# EAGLE design pc_healthypi_move_sensor_connector_v4 (EAGLE 9.6.2)
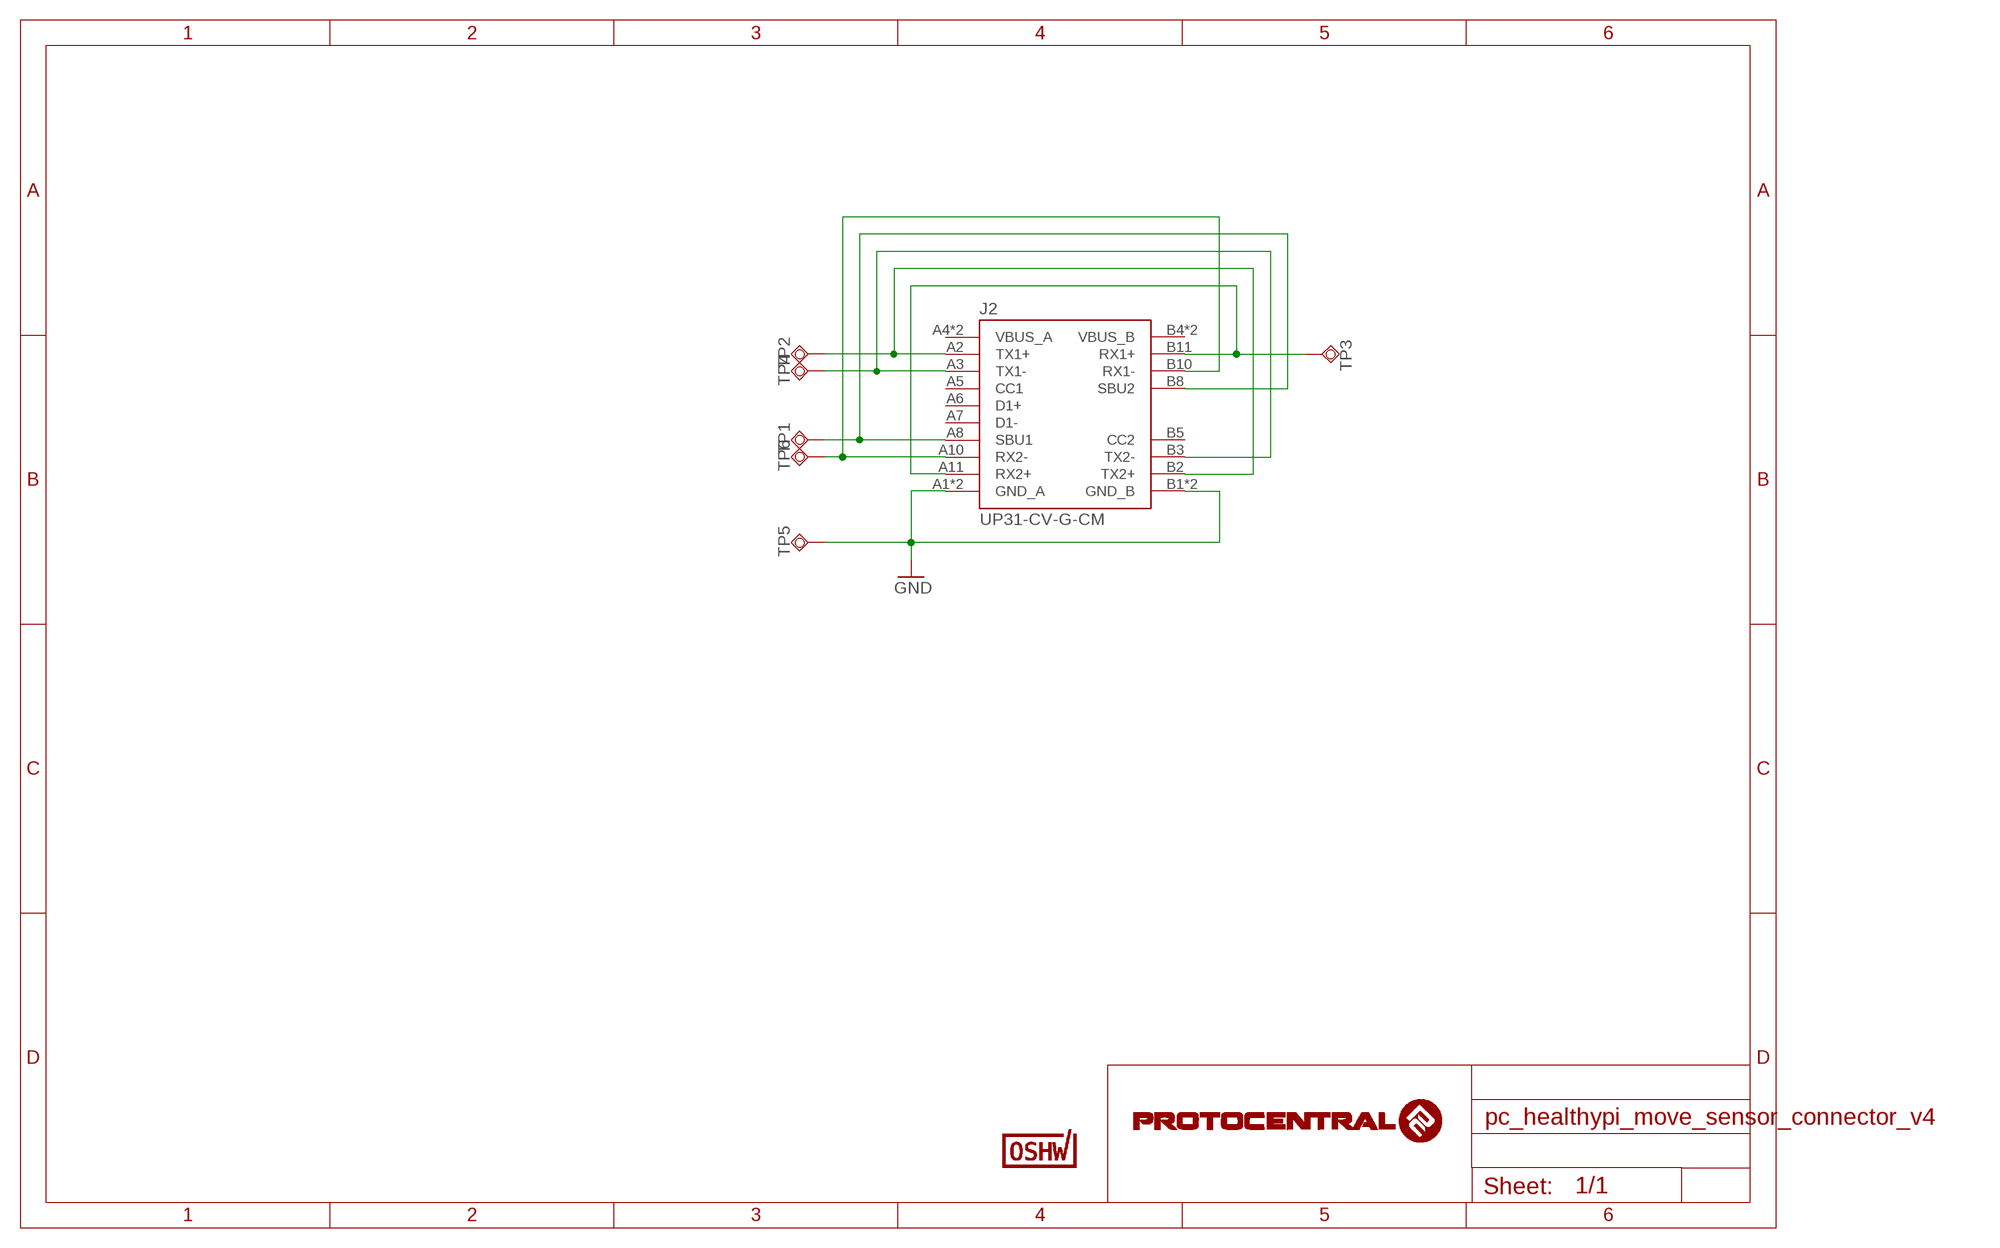
[diagram p0: schematic, sheet 1]

## Parts
J2  UP31-CV-G-CM  [CUI_UP31-CV-G-CM]
TP1  TPSQTP10SQ  [TP10SQ]
TP2  TPSQTP10SQ  [TP10SQ]
TP3  TPSQTP10SQ  [TP10SQ]
TP4  TPSQTP10SQ  [TP10SQ]
TP5  TPSQTP10SQ  [TP10SQ]
TP6  TPSQTP10SQ  [TP10SQ]
U$9  CERT-SMALL  [CERT-SMALL-SILK]

## Nets
GND: J2.A1(GND_A) J2.A12(GND_A) J2.B1(GND_B) J2.B12(GND_B) TP5.TP
N$3: J2.A2(TX1+) J2.B2(TX2+) TP2.TP
N$4: J2.A8(SBU1) J2.B8(SBU2) TP1.TP
N$5: J2.A3(TX1-) J2.B3(TX2-) TP4.TP
N$7: J2.A11(RX2+) J2.B11(RX1+) TP3.TP
N$8: J2.A10(RX2-) J2.B10(RX1-) TP6.TP
Unconnected: J2.A5(CC1) J2.A6(D1+) J2.A7(D1-) J2.B5(CC2)

## Power pins joined to a net without a drawn wire
VBUS_A: J2.A4(VBUS_A) J2.A9(VBUS_A)
VBUS_B: J2.B4(VBUS_B) J2.B9(VBUS_B)

## Library data of the parts
J2 = circuitects:UP31-CV-G-CM: Type C, USB 3.1 Gen 2, 5 A, Vertical, Cable Mount, USB Plug Connector; MANUFACTURER: CUI Devices; MAXIMUM_PACKAGE_HEIGHT: 3.48 mm; PARTREV: 1.02; STANDARD: Manufacturer recommendations
TP1-TP6 = testpad:TPSQ: Test pad
U$9 = OSHWA:CERT

## Board
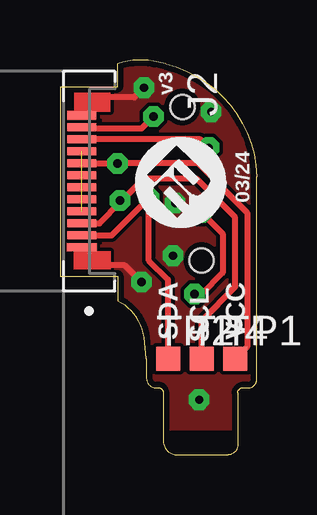
[diagram p1: board, top side]
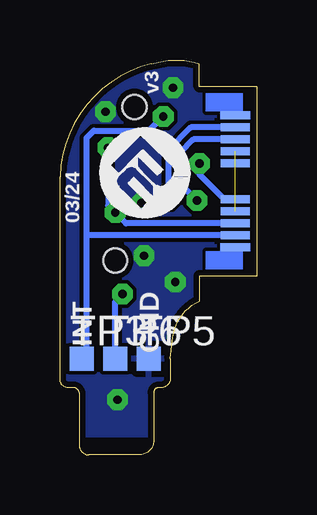
[diagram p2: board, bottom side, seen from below]

Size 8.2 x 16.45 mm. Coordinates in mm from the lower left corner, seen from the top.
Outline: 0,15.35 0,7.45 2.4,7.45 2.4,6.4 arc-60 3.5,4.9 3.6,4 3.6,3.2 arc90 4,2.8 4.1,2.8 arc-90 4.3,2.6 4.3,0.6 arc90 4.9,0 7,0 arc90 7.4,0.4 7.4,2.6 arc-90 7.7,2.8 7.9,2.8 arc90 8.2,3.2 8.2,11.6 arc74 4.4,16.3 3.9,16.4 arc30 2.4,16.3 2.4,15.35 0,15.35
Copper layers (1*16): Top 0.035mm / dielectric 0.73mm / Bottom 0.035mm
Design rules "Circuitects-Rules *": minimum track width 6mil, minimum drill 0.3mm, track to track 6mil, track to pad 6mil, pad to pad 6mil, via to via 6mil, smd to smd 6mil, copper to edge 10mil, drill to drill 8mil, minimum pad ring 12mil, minimum via ring 10mil, stop-mask expansion 4mil, vias tented up to drill 25mil, thermal gap 10mil
Holes 1 mm at 5.1,14.5 5.9,8.1

### Footprints (pad centres in the part's own frame; a part is rotated, then mirrored left to right if it is on the bottom)
CUI_UP31-CV-G-CM = smd 0.34 x 1.2: A1 2.75,0; A2 2.25,0; A3 1.75,0; A4 1.25,0; A5 0.75,0; A6 0.25,0; A7 -0.25,0; A8 -0.75,0; A9 -1.25,0; A10 -1.75,0; A11 -2.25,0; A12 -2.75,0 | smd 0.34 x 1.2 bottom: B1 -2.75,0; B2 -2.25,0; B3 -1.75,0; B4 -1.25,0; B5 -0.75,0; B8 0.75,0; B9 1.25,0; B10 1.75,0; B11 2.25,0; B12 2.75,0
TP10SQ = smd 1 x 1: TP 0,0

### Placement (x,y rotation side)
J2  0.9,11.4 270 top
TP1  7.3,4 0 top
TP2  4.5,4 0 top
TP3  7.3,4 0 bottom
TP4  5.9,4 0 top
TP5  4.5,4 0 bottom
TP6  5.9,4 0 bottom
U$2  [PCROUNDLOGO]  -0.5,7.3 0 top
U$3  [PCROUNDLOGO]  10.2,7.7 0 bottom
U$9  -6.6,-7.9 0 top  (outside the outline)

### Tracks (layer width: path | path; a pad name or v marks a point on that pad's centre or on a via)
GND  (via drill 0.35)
  Top 0.254: J2.B1 1.65,14.9 3.1,14.9 v3.5,15.3 | J2.B12 1.65,7.9 2.7,7.9 v3.4,7.2
  other vias: 4.7,8.3 6.3,14.3 5.8,2.3 4.8,10.5
  pour Bottom: 0,16.5 0,0.8 8.7,0.8 8.7,16.5
  pour Top: 0,16.5 0,1.1 8.7,1.1 8.7,16.5
N$3  (via drill 0.35)
  Top 0.254: J2.A2 2.15,9.15 v3.7,10.7 3.7,8.1 4.5,7.3 TP2.TP
  Bottom 0.254: J2.B2 2.75,13.65 3.7,12.7 v3.7,10.7
N$4  (via drill 0.35)
  Top 0.254: J2.A8 v2.39,12.15 5.75,12.15 7.8,10.1 7.8,4.5 TP1.TP
  Bottom 0.254: J2.B8 1.35,10.65 2.39,11.69 v2.39,12.15
N$5  (via drill 0.35)
  Top 0.254: J2.A3 1.65,9.65 2.5,10.5 v2.5,10.6 2.6,10.6 3.5,11.5 5.7,11.5 7.3,9.9 7.3,7 5.9,5.6 TP4.TP
  Bottom 0.254: J2.B3 2.65,13.15 3.2,12.6 3.2,11.3 v2.5,10.6
N$7  (via drill 0.35)
  Top 0.254: J2.A11 0.95,13.6 3.4,13.6 3.4,13.61 v3.9,14.11
  Bottom 0.254: v3.9,14.11 4.5,13.51 6.79,13.51 7.1,13.2 7.1,9.15 | 7.1,9.15 7.1,4.2 TP3.TP | J2.B11 7.1,9.15
N$8  (via drill 0.35)
  Top 0.254: v5.9,10.1 6.78,9.22 6.78,7.58 5.9,6.7 v5.6,6.7 | J2.A10 5.85,13.15 v6.2,12.8
  Bottom 0.254: TP6.TP 5.9,6.4 v5.6,6.7 | J2.B10 5.45,9.65 v5.9,10.1 6.2,10.4 v6.2,12.8
VBUS_A  (1 unrouted)
VBUS_B  (1 unrouted)

### Text on the board
tPlace: v3 | 03/24 | SDA | SCL | VCC
bPlace: v3 | 03/24 | GND | INT